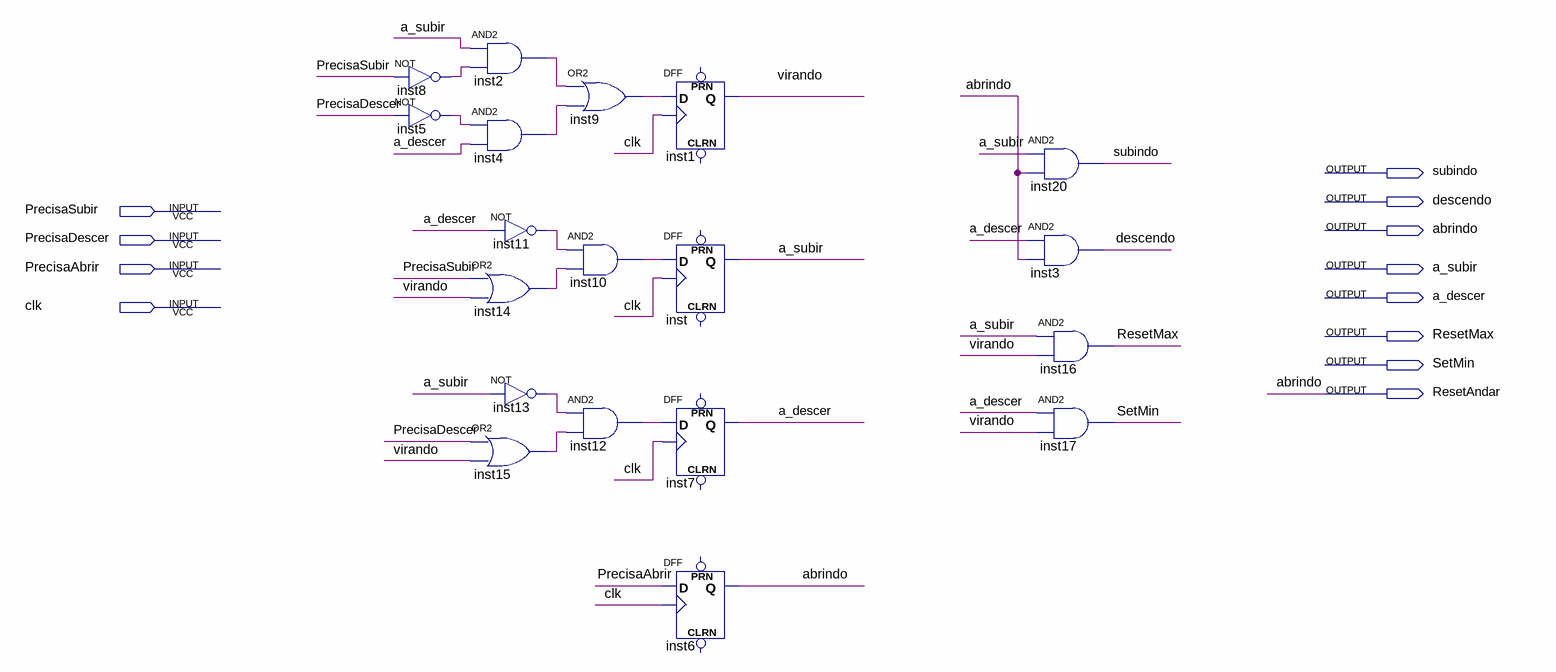
[diagram p0: schematic sheet]
// Quartus schematic ControleElevador.bdf as structural Verilog: 19 symbols, 12 pins
module ControleElevador (
  input  PrecisaSubir,
  input  PrecisaDescer,
  input  PrecisaAbrir,
  input  clk,
  output subindo,
  output descendo,
  output abrindo,
  output a_subir,
  output a_descer,
  output ResetMax,
  output SetMin,
  output ResetAndar
);

  wire inst2_out, inst4_out, inst5_out, inst8_out, inst9_out, inst10_out, inst11_out, inst12_out, inst13_out,
       inst14_out, inst15_out, virando;

  not inst8 (inst8_out, PrecisaSubir);
  not inst5 (inst5_out, PrecisaDescer);
  and inst2 (inst2_out, a_subir, inst8_out);
  and inst4 (inst4_out, inst5_out, a_descer);
  not inst11 (inst11_out, a_descer);
  or inst14 (inst14_out, PrecisaSubir, virando);
  not inst13 (inst13_out, a_subir);
  or inst15 (inst15_out, PrecisaDescer, virando);
  or inst9 (inst9_out, inst2_out, inst4_out);
  and inst10 (inst10_out, inst11_out, inst14_out);
  and inst12 (inst12_out, inst13_out, inst15_out);
  DFF inst1 (.CLK(clk), .D(inst9_out), .Q(virando));  // open: CLRN, PRN
  DFF inst (.CLK(clk), .D(inst10_out), .Q(a_subir));  // open: CLRN, PRN
  DFF inst7 (.CLK(clk), .D(inst12_out), .Q(a_descer));  // open: CLRN, PRN
  DFF inst6 (.CLK(clk), .D(PrecisaAbrir), .Q(abrindo));  // open: CLRN, PRN
  and inst20 (subindo, a_subir, abrindo);
  and inst3 (descendo, a_descer, abrindo);
  and inst16 (ResetMax, a_subir, virando);
  and inst17 (SetMin, a_descer, virando);

  assign ResetAndar = abrindo;
endmodule
